# Altium schematic sheet outputs.SchDoc
size A3
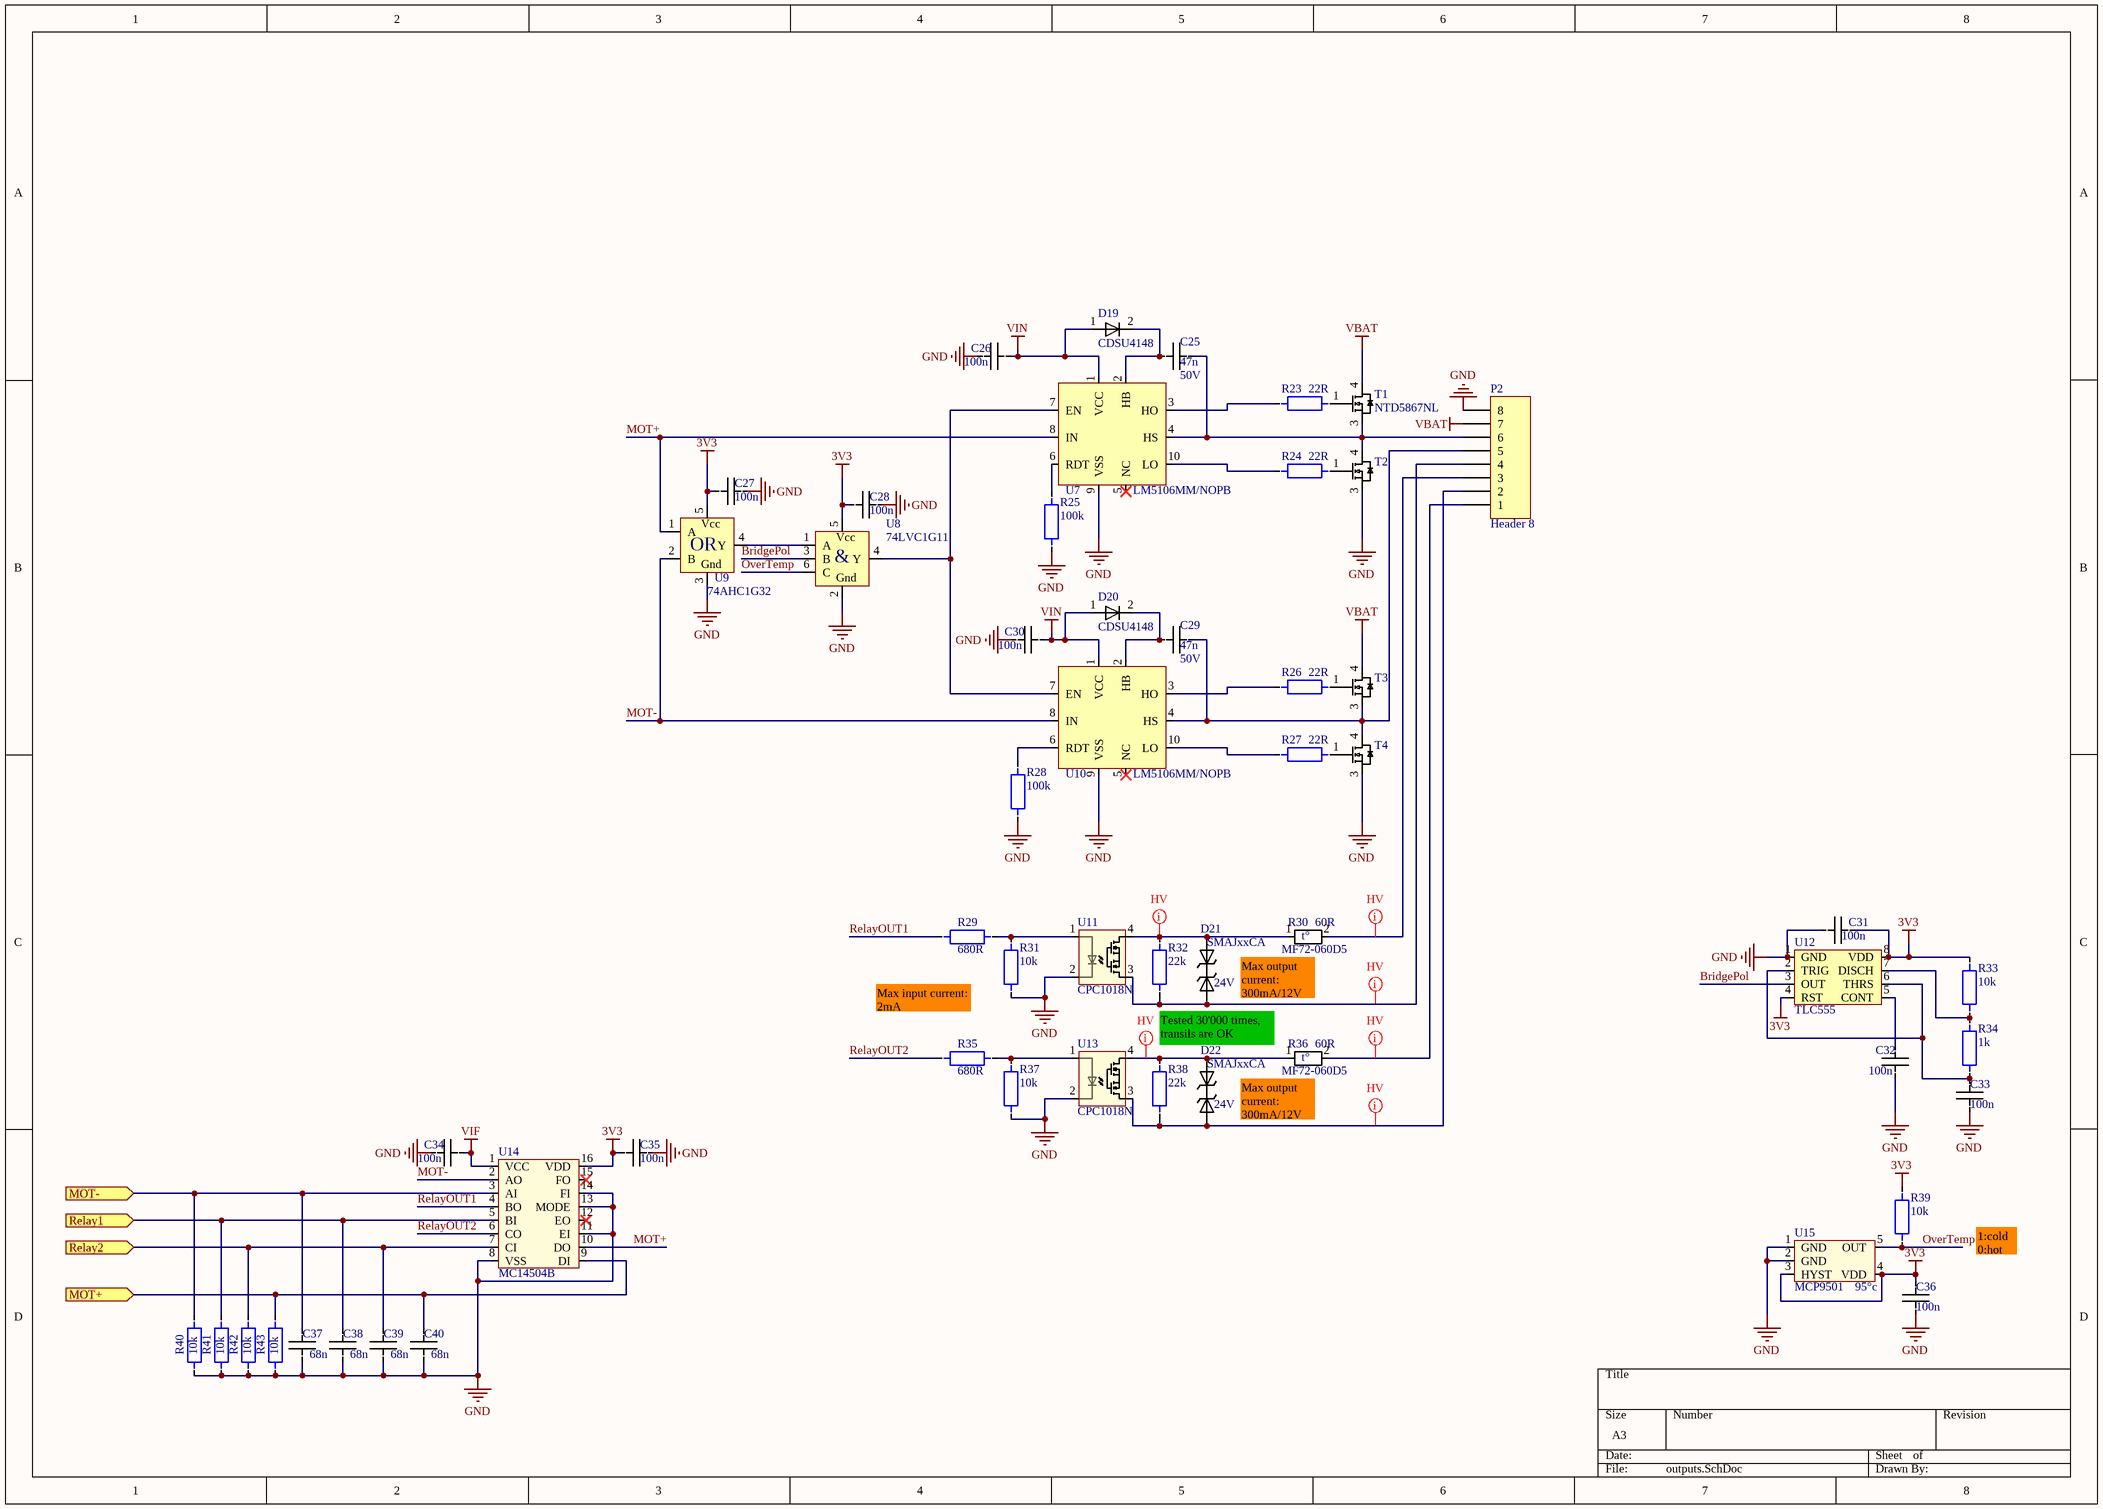
[diagram p0: outputs.SchDoc]

## Parts
C25  Voltage: 50V  [0402_]  (hidden comment: 47n)
C26  100n  [0402_]
C27  100n  [0402_]
C28  100n  [0402_]
C29  Voltage: 50V  [0402_]  (hidden comment: 47n)
C30  100n  [0402_]
C31  100n  [0402_]
C32  100n  [0402_]
C33  100n  [0402_]
C34  100n  [0402_]
C35  100n  [0402_]
C36  100n  [0402_]
C37  68n  [0603_]
C38  68n  [0603_]
C39  68n  [0603_]
C40  68n  [0603_]
D19  CDSU4148  [0603_Pol]
D20  CDSU4148  [0603_Pol]
D21  SMAJxxCA  Vbreakdown: 24V  [DO-214AC]
D22  SMAJxxCA  Vbreakdown: 24V  [DO-214AC]
P2  Header 8  [PHOENIX_SMKDSN8]
R23  22R  [0805_]
R24  22R  [0805_]
R25  100k  [0402_]
R26  22R  [0805_]
R27  22R  [0805_]
R28  100k  [0402_]
R29  680R  [0402_]
R30  MF72-060D5  Value@25°c: 60R  [MF72-010D5]
R31  10k  [0402_]
R32  22k  [0805_]
R33  10k  [0402_]
R34  1k  [0402_]
R35  680R  [0402_]
R36  MF72-060D5  Value@25°c: 60R  [MF72-010D5]
R37  10k  [0402_]
R38  22k  [0805_]
R39  10k  [0402_]
R40  10k  [0402_]
R41  10k  [0402_]
R42  10k  [0402_]
R43  10k  [0402_]
T1  NTD5867NL  [DPAK]
T2  NTD5867NL  [DPAK]  (value not drawn)
T3  NTD5867NL  [DPAK]  (value not drawn)
T4  NTD5867NL  [DPAK]  (value not drawn)
U7  LM5106MM/NOPB  [VSSOP10]
U8  74LVC1G11  [SOT363]
U9  74AHC1G32  [SOT353]
U10  LM5106MM/NOPB  [VSSOP10]
U11  CPC1018N  [CPC10xxN]
U12  TLC555  [soic8]
U13  CPC1018N  [CPC10xxN]
U14  MC14504B  [SOIC16]
U15  MCP9501  TSET: 95°c  [SOT23-5]

## Ports
MOT+ (in), MOT- (in), Relay1 (in), Relay2 (in)

## Nets
3V3: C27.1 C28.1 C31.2 C35.2 C36.1 R33.2 R39.2 U8.5(Vcc) U9.5(VCC) U12.4(RST) U12.8(VDD) U14.16(VDD) U15.3(HYST) U15.4(VDD)
GND: C26.1 C27.2 C28.2 C30.1 C31.1 C32.1 C33.1 C34.1 C35.1 C36.2 C37.1 C38.1 C39.1 C40.1 P2.8 R25.1 R28.1 R31.1 R37.1 R40.1 R41.1 R42.1 R43.1 T2.3(S) T4.3(S) U7.9(VSS) U8.2(GND) U9.3(GND) U10.9(VSS) U11.2(Ca) U12.1(GND) U13.2(Ca) U14.8(VSS) U14.11(EI) U14.13(MODE) U14.14(FI) U15.1(GND) U15.2(GND)
VBAT: P2.7 T1.4(D) T3.4(D)
VIF: C34.2 U14.1(VCC)
VIN: C26.2 C30.2 D19.1 D20.1 U7.1(VCC) U10.1(VCC)
BridgePol: U8.3(B) U12.3(OUT)
MOT+: U7.8(IN) U9.1(A) U14.10(DO)
MOT+: C40.2 R43.2 U14.9(DI) ; port MOT+  [a separate net that carries the same name]
MOT-: U9.2(B) U10.8(IN) U14.2(AO)
MOT-: C37.2 R40.2 U14.3(AI) ; port MOT-  [a separate net that carries the same name]
OverTemp: R39.1 U8.6(C) U15.5(OUT)
Relay1: C38.2 R41.2 U14.5(BI) ; port Relay1
Relay2: C39.2 R42.2 U14.7(CI) ; port Relay2
RelayOUT1: R29.2 U14.4(BO)
RelayOUT2: R35.2 U14.6(CO)
NetC25_1: C25.1 D19.2 U7.2(HB)
NetC25_2: C25.2 P2.6 T1.3(S) T2.4(D) U7.4(HS)
NetC29_1: C29.1 D20.2 U10.2(HB)
NetC29_2: C29.2 P2.5 T3.3(S) T4.4(D) U10.4(HS)
NetC32_2: C32.2 U12.5(CONT)
NetC33_2: C33.2 R34.2 U12.2(TRIG) U12.6(THRS)
NetD21_1: D21.1 P2.4 R32.1 U11.3(DC-)
NetD21_2: D21.2 R30.1 R32.2 U11.4(DC+)
NetD22_1: D22.1 P2.2 R38.1 U13.3(DC-)
NetD22_2: D22.2 R36.1 R38.2 U13.4(DC+)
NetP2_1: P2.1 R36.2
NetP2_3: P2.3 R30.2
NetR23_1: R23.1 T1.1(G)
NetR23_2: R23.2 U7.3(HO)
NetR24_1: R24.1 T2.1(G)
NetR24_2: R24.2 U7.10(LO)
NetR25_2: R25.2 U7.6(RDT)
NetR26_1: R26.1 T3.1(G)
NetR26_2: R26.2 U10.3(HO)
NetR27_1: R27.1 T4.1(G)
NetR27_2: R27.2 U10.10(LO)
NetR28_2: R28.2 U10.6(RDT)
NetR29_1: R29.1 R31.2 U11.1(A)
NetR33_1: R33.1 R34.1 U12.7(DISCH)
NetR35_1: R35.1 R37.2 U13.1(A)
NetU7_7: U7.7(EN) U8.4(Y) U10.7(EN)
NetU8_1: U8.1(A) U9.4(Y)

Not connected (* = marked no-connect by the designer): U7 5(NC)*; U10 5(NC)*; U14 12(EO)* 15(FO)*

## Layout directives
net class HV_NET: NetD21_1, NetD21_2, NetD22_1, NetD22_2, NetP2_1, NetP2_3

## Notes on the sheet
- Max output current: 300mA/12V
- Max input current: 2mA
- Tested 30'000 times, transils are OK
- 1:cold
  0:hot
- (in symbol 74AHC1G32) Vcc; OR; Gnd
- (in symbol 74LVC1G11) &; Gnd
- (in symbol MF72-060D5) t°

## Library data of the parts
C25 C29 = C: Manufacturer: Murata; Manufacturer PartNum: GRM155R71H473KE14D; value: 47n; Digikey ref: 490-10702-1-ND
C26 C30 C34 C35 = C: Manufacturer: TDK Corp.; Manufacturer PartNum: C1005X5R1E104K050BC; value: 100n; Digikey ref: 445-4964-1-ND
C27 C28 C31-C33 C36 = C: Manufacturer: TDK Corp.; Manufacturer PartNum: C1005X5R1E104K050BC; Voltage: 25V; value: 100n; Digikey ref: 445-4964-1-ND
C37-C40 = C: Manufacturer: Samsung; Manufacturer PartNum: CL10B683KB8NNNC; Nominal voltage: 50V; Digikey ref: 1276-1814-1-ND; Value: 68n
D19 D20 = CDSU4148: Manufacturer: Comchip Tech.; Imax: 150mA; VF@Imax: 1; Farnell ref: *; Digikey ref: 641-1001-1-ND; Manufacturer PartNum: CDSU4148
D21 D22 = SMAJxxCA: SMAJ Transient Voltage Suppressor Diode Series; Manufacturer PartNum: SMAJ24CA; Manufacturer: Littelfuse Inc; Digikey ref: SMAJ24CALFCT-ND
P2 = Header 8: Header, 8-Pin; Manufacturer PartNum: 1869279; Manufacturer: Phoenix; LatestRevisionDate: 17-Jul-2002; LatestRevisionNote: Re-released for DXP Platform.; Publisher: Altium Limited; Digikey ref: 277-5855-ND
R23 R24 R26 R27 = R: Manufacturer PartNum: ERJ-6ENF22R0V; Manufacturer: Panasonic; value: 22R; Digikey ref: P22.0CCT-ND
R25 R28 = R: Manufacturer: Susumu; Manufacturer PartNum: RR0510P-104-D; value: 100k; Digikey ref: RR05P100KDCT-ND
R29 R35 = R: Manufacturer PartNum: ERJ-2RKF6800X; Manufacturer: Panasonic; value: 680R; Digikey ref: P680LCT-ND
R30 R36 = MF72-060D5: Manufacturer: Cantherm; Digikey ref: 317-1146-ND; Manufacturer PartNum: MF72-060D5
R31 R33 R37 R39-R43 = R: Manufacturer PartNum: ERJ-2RKF1002X; Manufacturer: Panasonic; value: 10k; Digikey ref: P10.0KLCT-ND
R32 R38 = R: Manufacturer: Rohm Semi; Manufacturer PartNum: ESR10EZPJ223; value: 22k; Digikey ref: RHM22KKCT-ND
R34 = R: Manufacturer PartNum: MCR01MRTF1001; Manufacturer: Rohm Semi; value: 1k; Digikey ref: RHM1.00KCDCT-ND
T1-T4 = NTD5867NL: Manufacturer: On Semi; Manufacturer PartNum: NTD5867NLT4G; Digikey ref: NTD5867NLT4GOSCT-ND
U7 U10 = LM5106MM/NOPB: Manufacturer: Texas Intruments; Digikey ref: LM5106MM/NOPBCT-ND; Manufacturer PartNum: LM5106MM/NOPB
U8 = 74LVC1G11: IC GATE AND 1CH 3-INP SOT-363; Manufacturer: Diodes Inc.; Manufacturer PartNum: 74LVC1G11DW-7; Digikey ref: 74LVC1G11DW-7CT-ND
U9 = 74AHC1G32: Manufacturer: Diodes Inc.; Manufacturer PartNum: 74AHC1G32SE-7; Digikey ref: 74AHC1G32SE-7DICT-ND
U11 U13 = CPC1018N: Manufacturer PartNum: CPC1018NTR; Manufacturer: IXYS Integrated; Digikey ref: CLA225CT-ND; Farnell ref: *
U12 = TLC555: IC OSC SGL TIMER 2.1MHZ 8-SOIC; Manufacturer: Texas Intruments; Manufacturer PartNum: TLC555CDR; Digikey ref: 296-1336-1-ND
U14 = MC14504B: IC LEVEL SHIFTER HEX 16-SOIC; Manufacturer: On Semi; Manufacturer PartNum: MC14504BDG; Digikey ref: MC14504BDGOS-ND
U15 = MCP9501: Manufacturer: Microchip; Manufacturer PartNum: MCP9501PT-095E/OT; Digikey ref: MCP9501PT-095E/OTCT-ND